# Altium project Controller-RK3562.PrjPcb (part 4 of 8)

## Sheet DDR-LPDDR4.SchDoc
size 420 x 297 mm; SheetNumber: 13; SheetTotal: 32
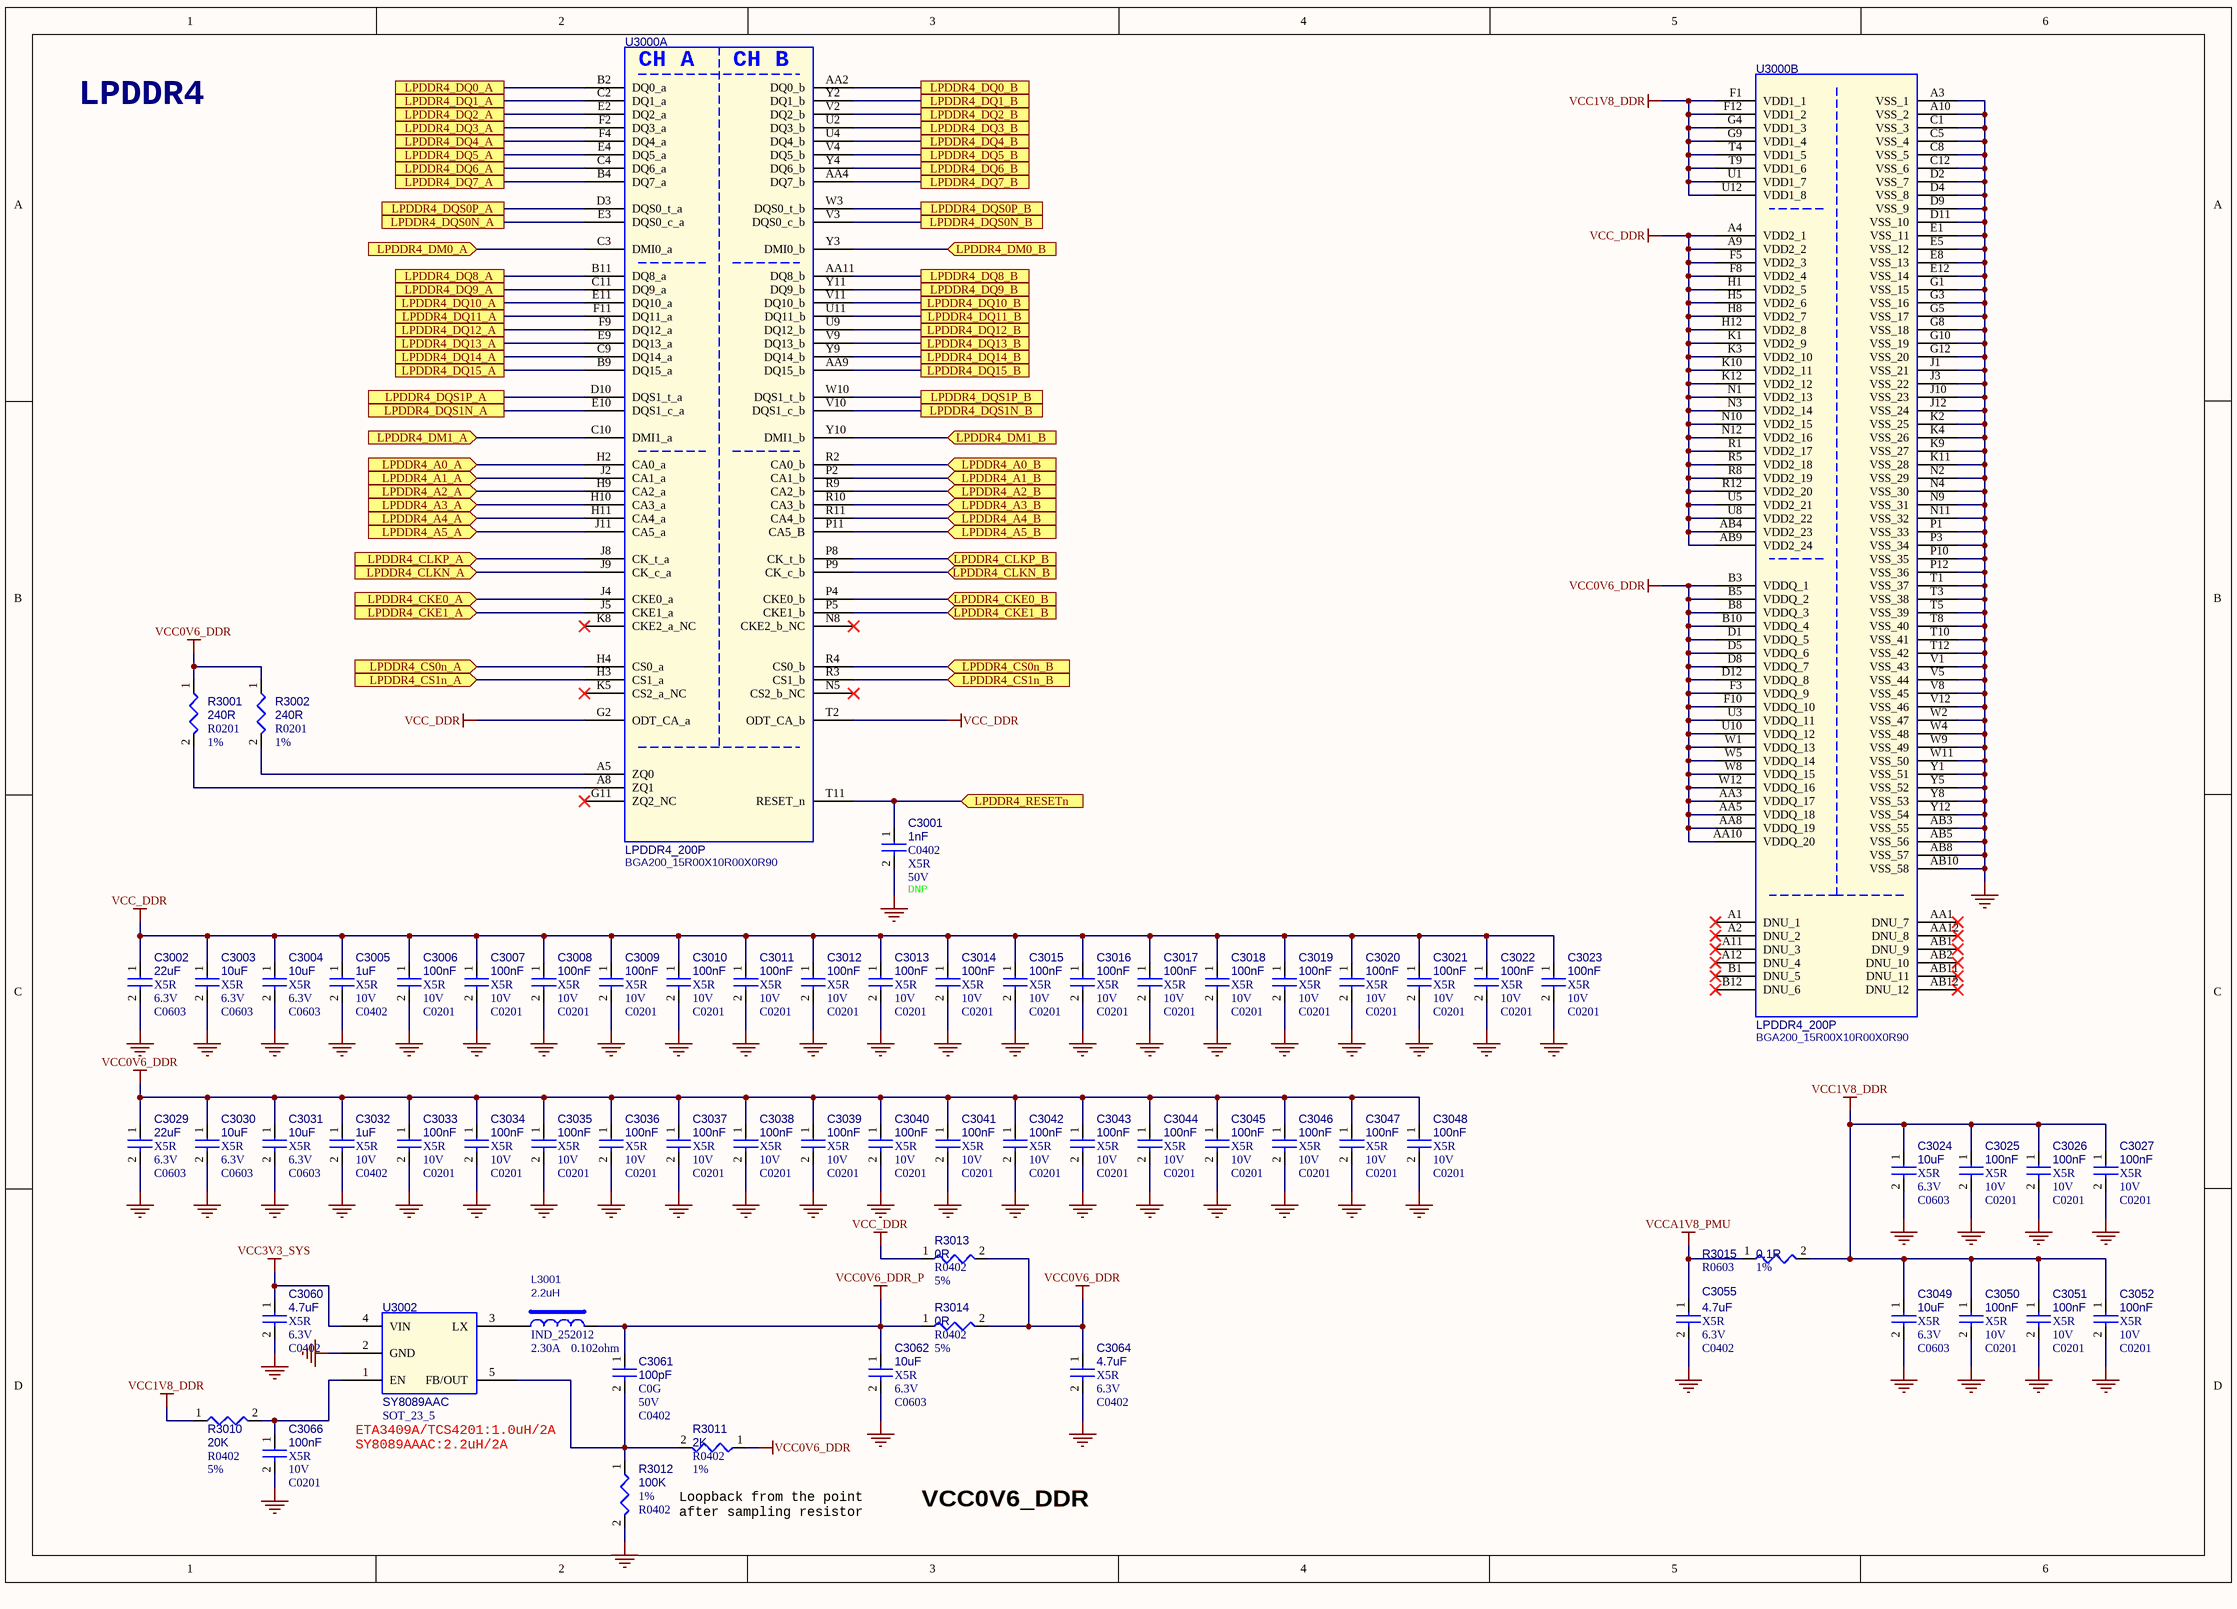
[diagram p14: DDR-LPDDR4.SchDoc]

### Parts
C3001  1nF  Dielectric: X5R  Voltage: 50V  option: DNP  [C0402]
C3002  22uF  Dielectric: X5R  Voltage: 6.3V  [C0603]
C3003  10uF  Dielectric: X5R  Voltage: 6.3V  [C0603]
C3004  10uF  Dielectric: X5R  Voltage: 6.3V  [C0603]
C3005  1uF  Dielectric: X5R  Voltage: 10V  [C0402]
C3006  100nF  Dielectric: X5R  Voltage: 10V  [C0201]
C3007  100nF  Dielectric: X5R  Voltage: 10V  [C0201]
C3008  100nF  Dielectric: X5R  Voltage: 10V  [C0201]
C3009  100nF  Dielectric: X5R  Voltage: 10V  [C0201]
C3010  100nF  Dielectric: X5R  Voltage: 10V  [C0201]
C3011  100nF  Dielectric: X5R  Voltage: 10V  [C0201]
C3012  100nF  Dielectric: X5R  Voltage: 10V  [C0201]
C3013  100nF  Dielectric: X5R  Voltage: 10V  [C0201]
C3014  100nF  Dielectric: X5R  Voltage: 10V  [C0201]
C3015  100nF  Dielectric: X5R  Voltage: 10V  [C0201]
C3016  100nF  Dielectric: X5R  Voltage: 10V  [C0201]
C3017  100nF  Dielectric: X5R  Voltage: 10V  [C0201]
C3018  100nF  Dielectric: X5R  Voltage: 10V  [C0201]
C3019  100nF  Dielectric: X5R  Voltage: 10V  [C0201]
C3020  100nF  Dielectric: X5R  Voltage: 10V  [C0201]
C3021  100nF  Dielectric: X5R  Voltage: 10V  [C0201]
C3022  100nF  Dielectric: X5R  Voltage: 10V  [C0201]
C3023  100nF  Dielectric: X5R  Voltage: 10V  [C0201]
C3024  10uF  Dielectric: X5R  Voltage: 6.3V  [C0603]
C3025  100nF  Dielectric: X5R  Voltage: 10V  [C0201]
C3026  100nF  Dielectric: X5R  Voltage: 10V  [C0201]
C3027  100nF  Dielectric: X5R  Voltage: 10V  [C0201]
C3029  22uF  Dielectric: X5R  Voltage: 6.3V  [C0603]
C3030  10uF  Dielectric: X5R  Voltage: 6.3V  [C0603]
C3031  10uF  Dielectric: X5R  Voltage: 6.3V  [C0603]
C3032  1uF  Dielectric: X5R  Voltage: 10V  [C0402]
C3033  100nF  Dielectric: X5R  Voltage: 10V  [C0201]
C3034  100nF  Dielectric: X5R  Voltage: 10V  [C0201]
C3035  100nF  Dielectric: X5R  Voltage: 10V  [C0201]
C3036  100nF  Dielectric: X5R  Voltage: 10V  [C0201]
C3037  100nF  Dielectric: X5R  Voltage: 10V  [C0201]
C3038  100nF  Dielectric: X5R  Voltage: 10V  [C0201]
C3039  100nF  Dielectric: X5R  Voltage: 10V  [C0201]
C3040  100nF  Dielectric: X5R  Voltage: 10V  [C0201]
C3041  100nF  Dielectric: X5R  Voltage: 10V  [C0201]
C3042  100nF  Dielectric: X5R  Voltage: 10V  [C0201]
C3043  100nF  Dielectric: X5R  Voltage: 10V  [C0201]
C3044  100nF  Dielectric: X5R  Voltage: 10V  [C0201]
C3045  100nF  Dielectric: X5R  Voltage: 10V  [C0201]
C3046  100nF  Dielectric: X5R  Voltage: 10V  [C0201]
C3047  100nF  Dielectric: X5R  Voltage: 10V  [C0201]
C3048  100nF  Dielectric: X5R  Voltage: 10V  [C0201]
C3049  10uF  Dielectric: X5R  Voltage: 6.3V  [C0603]
C3050  100nF  Dielectric: X5R  Voltage: 10V  [C0201]
C3051  100nF  Dielectric: X5R  Voltage: 10V  [C0201]
C3052  100nF  Dielectric: X5R  Voltage: 10V  [C0201]
C3055  4.7uF  Dielectric: X5R  Voltage: 6.3V  [C0402]
C3060  4.7uF  Dielectric: X5R  Voltage: 6.3V  [C0402]
C3061  100pF  Dielectric: C0G  Voltage: 50V  [C0402]
C3062  10uF  Dielectric: X5R  Voltage: 6.3V  [C0603]
C3064  4.7uF  Dielectric: X5R  Voltage: 6.3V  [C0402]
C3066  100nF  Dielectric: X5R  Voltage: 10V  [C0201]
L3001  2.2uH  Isat: 2.30A  DC Resistor: 0.102ohm  [IND_252012]
R3001  240R  Tolerance: 1%  [R0201]
R3002  240R  Tolerance: 1%  [R0201]
R3010  20K  Tolerance: 5%  [R0402]
R3011  2K  Tolerance: 1%  [R0402]
R3012  100K  Tolerance: 1%  [R0402]
R3013  0R  Tolerance: 5%  [R0402]
R3014  0R  Tolerance: 5%  [R0402]
R3015  0.1R  Tolerance: 1%  [R0603]
U3000  LPDDR4_200P  [BGA200_15R00X10R00X0R90]  (parts A,B of 2)
U3002  SY8089AAC  [SOT_23_5]

### Ports
LPDDR4_A0_A (in, see CONTROLLER-RK3562[7B], RK3562-DDR-PHY[5B]), LPDDR4_A0_B (in, see CONTROLLER-RK3562[7C], RK3562-DDR-PHY[5B]), LPDDR4_A1_A (in, see CONTROLLER-RK3562[7B], RK3562-DDR-PHY[5A]), LPDDR4_A1_B (in, see CONTROLLER-RK3562[7C], RK3562-DDR-PHY[5A]), LPDDR4_A2_A (in, see CONTROLLER-RK3562[7B], RK3562-DDR-PHY[5B]), LPDDR4_A2_B (in, see CONTROLLER-RK3562[7C], RK3562-DDR-PHY[5B]), LPDDR4_A3_A (in, see CONTROLLER-RK3562[7B], RK3562-DDR-PHY[5B]), LPDDR4_A3_B (in, see CONTROLLER-RK3562[7C], RK3562-DDR-PHY[5A]), LPDDR4_A4_A (in, see CONTROLLER-RK3562[7B], RK3562-DDR-PHY[5B]), LPDDR4_A4_B (in, see CONTROLLER-RK3562[7C], RK3562-DDR-PHY[5B]), LPDDR4_A5_A (in, see CONTROLLER-RK3562[7B], RK3562-DDR-PHY[5B]), LPDDR4_A5_B (in, see CONTROLLER-RK3562[7C], RK3562-DDR-PHY[5A]), LPDDR4_CKE0_A (in, see CONTROLLER-RK3562[7B], RK3562-DDR-PHY[5B]), LPDDR4_CKE0_B (in, see CONTROLLER-RK3562[7C], RK3562-DDR-PHY[5B]), LPDDR4_CKE1_A (in, see CONTROLLER-RK3562[7B], RK3562-DDR-PHY[5B]), LPDDR4_CKE1_B (in, see CONTROLLER-RK3562[7C], RK3562-DDR-PHY[5B]), LPDDR4_CLKN_A (in, see CONTROLLER-RK3562[7B], RK3562-DDR-PHY[5B]), LPDDR4_CLKN_B (in, see CONTROLLER-RK3562[7C], RK3562-DDR-PHY[5A]), LPDDR4_CLKP_A (in, see CONTROLLER-RK3562[7B], RK3562-DDR-PHY[5B]), LPDDR4_CLKP_B (in, see CONTROLLER-RK3562[7C], RK3562-DDR-PHY[5B]), LPDDR4_CS0n_A (in, see CONTROLLER-RK3562[7B], RK3562-DDR-PHY[5A]), LPDDR4_CS0n_B (in, see CONTROLLER-RK3562[7C], RK3562-DDR-PHY[5B]), LPDDR4_CS1n_A (in, see CONTROLLER-RK3562[7B], RK3562-DDR-PHY[5B]), LPDDR4_CS1n_B (in, see CONTROLLER-RK3562[7C], RK3562-DDR-PHY[5B]), LPDDR4_DM0_A (in, see CONTROLLER-RK3562[7B], RK3562-DDR-PHY[1B]), LPDDR4_DM0_B (in, see CONTROLLER-RK3562[7C], RK3562-DDR-PHY[1C]), LPDDR4_DM1_A (in, see CONTROLLER-RK3562[7B], RK3562-DDR-PHY[1B]), LPDDR4_DM1_B (in, see CONTROLLER-RK3562[7C], RK3562-DDR-PHY[1C]), LPDDR4_DQ0_A (see CONTROLLER-RK3562[7B], RK3562-DDR-PHY[1A]), LPDDR4_DQ0_B (see CONTROLLER-RK3562[7C], RK3562-DDR-PHY[1B]), LPDDR4_DQ1_A (see CONTROLLER-RK3562[7B], RK3562-DDR-PHY[1A]), LPDDR4_DQ1_B (see CONTROLLER-RK3562[7C], RK3562-DDR-PHY[1B]), LPDDR4_DQ2_A (see CONTROLLER-RK3562[7B], RK3562-DDR-PHY[1A]), LPDDR4_DQ2_B (see CONTROLLER-RK3562[7C], RK3562-DDR-PHY[1B]), LPDDR4_DQ3_A (see CONTROLLER-RK3562[7B], RK3562-DDR-PHY[1A]), LPDDR4_DQ3_B (see CONTROLLER-RK3562[7C], RK3562-DDR-PHY[1B]), LPDDR4_DQ4_A (see CONTROLLER-RK3562[7B], RK3562-DDR-PHY[1A]), LPDDR4_DQ4_B (see CONTROLLER-RK3562[7C], RK3562-DDR-PHY[1B]), LPDDR4_DQ5_A (see CONTROLLER-RK3562[7B], RK3562-DDR-PHY[1A]), LPDDR4_DQ5_B (see CONTROLLER-RK3562[7C], RK3562-DDR-PHY[1B]), LPDDR4_DQ6_A (see CONTROLLER-RK3562[7B], RK3562-DDR-PHY[1A]), LPDDR4_DQ6_B (see CONTROLLER-RK3562[7C], RK3562-DDR-PHY[1B]), LPDDR4_DQ7_A (see CONTROLLER-RK3562[7B], RK3562-DDR-PHY[1A]), LPDDR4_DQ7_B (see CONTROLLER-RK3562[7C], RK3562-DDR-PHY[1C]), LPDDR4_DQ8_A (see CONTROLLER-RK3562[7B], RK3562-DDR-PHY[1B]), LPDDR4_DQ8_B (see CONTROLLER-RK3562[7C], RK3562-DDR-PHY[1C]), LPDDR4_DQ9_A (see CONTROLLER-RK3562[7B], RK3562-DDR-PHY[1B]), LPDDR4_DQ9_B (see CONTROLLER-RK3562[7C], RK3562-DDR-PHY[1C]), LPDDR4_DQ10_A (see CONTROLLER-RK3562[7B], RK3562-DDR-PHY[1B]), LPDDR4_DQ10_B (see CONTROLLER-RK3562[7C], RK3562-DDR-PHY[1C]), LPDDR4_DQ11_A (see CONTROLLER-RK3562[7B], RK3562-DDR-PHY[1B]), LPDDR4_DQ11_B (see CONTROLLER-RK3562[7C], RK3562-DDR-PHY[1C]), LPDDR4_DQ12_A (see CONTROLLER-RK3562[7B], RK3562-DDR-PHY[1B]), LPDDR4_DQ12_B (see CONTROLLER-RK3562[7C], RK3562-DDR-PHY[1C]), LPDDR4_DQ13_A (see CONTROLLER-RK3562[7B], RK3562-DDR-PHY[1B]), LPDDR4_DQ13_B (see CONTROLLER-RK3562[7C], RK3562-DDR-PHY[1C]), LPDDR4_DQ14_A (see CONTROLLER-RK3562[7B], RK3562-DDR-PHY[1B]), LPDDR4_DQ14_B (see CONTROLLER-RK3562[7C], RK3562-DDR-PHY[1C]), LPDDR4_DQ15_A (see CONTROLLER-RK3562[7B], RK3562-DDR-PHY[1B]), LPDDR4_DQ15_B (see CONTROLLER-RK3562[7C], RK3562-DDR-PHY[1C]), LPDDR4_DQS0N_A (see CONTROLLER-RK3562[7B], RK3562-DDR-PHY[1B]), LPDDR4_DQS0N_B (see CONTROLLER-RK3562[7C], RK3562-DDR-PHY[1C]), LPDDR4_DQS0P_A (see CONTROLLER-RK3562[7B], RK3562-DDR-PHY[1B]), LPDDR4_DQS0P_B (see CONTROLLER-RK3562[7C], RK3562-DDR-PHY[1C]), LPDDR4_DQS1N_A (see CONTROLLER-RK3562[7B], RK3562-DDR-PHY[1B]), LPDDR4_DQS1N_B (see CONTROLLER-RK3562[7C], RK3562-DDR-PHY[1C]), LPDDR4_DQS1P_A (see CONTROLLER-RK3562[7B], RK3562-DDR-PHY[1B]), LPDDR4_DQS1P_B (see CONTROLLER-RK3562[7C], RK3562-DDR-PHY[1C]), LPDDR4_RESETn (in, see CONTROLLER-RK3562[7C], RK3562-DDR-PHY[5C])

### Nets
GND: C3001.2 C3002.2 C3003.2 C3004.2 C3005.2 C3006.2 C3007.2 C3008.2 C3009.2 C3010.2 C3011.2 C3012.2 C3013.2 C3014.2 C3015.2 C3016.2 C3017.2 C3018.2 C3019.2 C3020.2 C3021.2 C3022.2 C3023.2 C3024.2 C3025.2 C3026.2 C3027.2 C3029.2 C3030.2 C3031.2 C3032.2 C3033.2 C3034.2 C3035.2 C3036.2 C3037.2 C3038.2 C3039.2 C3040.2 C3041.2 C3042.2 C3043.2 C3044.2 C3045.2 C3046.2 C3047.2 C3048.2 C3049.2 C3050.2 C3051.2 C3052.2 C3055.2 C3060.2 C3062.2 C3064.2 C3066.2 R3012.2 U3000.A3(VSS_1) U3000.A10(VSS_2) U3000.AB3(VSS_55) U3000.AB5(VSS_56) U3000.AB8(VSS_57) U3000.AB10(VSS_58) U3000.C1(VSS_3) U3000.C5(VSS_4) U3000.C8(VSS_5) U3000.C12(VSS_6) U3000.D2(VSS_7) U3000.D4(VSS_8) U3000.D9(VSS_9) U3000.D11(VSS_10) U3000.E1(VSS_11) U3000.E5(VSS_12) U3000.E8(VSS_13) U3000.E12(VSS_14) U3000.G1(VSS_15) U3000.G3(VSS_16) U3000.G5(VSS_17) U3000.G8(VSS_18) U3000.G10(VSS_19) U3000.G12(VSS_20) U3000.J1(VSS_21) U3000.J3(VSS_22) U3000.J10(VSS_23) U3000.J12(VSS_24) U3000.K2(VSS_25) U3000.K4(VSS_26) U3000.K9(VSS_27) U3000.K11(VSS_28) U3000.N2(VSS_29) U3000.N4(VSS_30) U3000.N9(VSS_31) U3000.N11(VSS_32) U3000.P1(VSS_33) U3000.P3(VSS_34) U3000.P10(VSS_35) U3000.P12(VSS_36) U3000.T1(VSS_37) U3000.T3(VSS_38) U3000.T5(VSS_39) U3000.T8(VSS_40) U3000.T10(VSS_41) U3000.T12(VSS_42) U3000.V1(VSS_43) U3000.V5(VSS_44) U3000.V8(VSS_45) U3000.V12(VSS_46) U3000.W2(VSS_47) U3000.W4(VSS_48) U3000.W9(VSS_49) U3000.W11(VSS_50) U3000.Y1(VSS_51) U3000.Y5(VSS_52) U3000.Y8(VSS_53) U3000.Y12(VSS_54) U3002.2(GND)
VCC0V6_DDR: C3029.1 C3030.1 C3031.1 C3032.1 C3033.1 C3034.1 C3035.1 C3036.1 C3037.1 C3038.1 C3039.1 C3040.1 C3041.1 C3042.1 C3043.1 C3044.1 C3045.1 C3046.1 C3047.1 C3048.1 C3064.1 R3001.1 R3002.1 R3011.1 R3013.2 R3014.2 U3000.AA3(VDDQ_17) U3000.AA5(VDDQ_18) U3000.AA8(VDDQ_19) U3000.AA10(VDDQ_20) U3000.B3(VDDQ_1) U3000.B5(VDDQ_2) U3000.B8(VDDQ_3) U3000.B10(VDDQ_4) U3000.D1(VDDQ_5) U3000.D5(VDDQ_6) U3000.D8(VDDQ_7) U3000.D12(VDDQ_8) U3000.F3(VDDQ_9) U3000.F10(VDDQ_10) U3000.U3(VDDQ_11) U3000.U10(VDDQ_12) U3000.W1(VDDQ_13) U3000.W5(VDDQ_14) U3000.W8(VDDQ_15) U3000.W12(VDDQ_16)
VCC0V6_DDR_P: C3061.1 C3062.1 L3001.2 R3014.1
VCC1V8_DDR: C3024.1 C3025.1 C3026.1 C3027.1 C3049.1 C3050.1 C3051.1 C3052.1 R3010.1 R3015.2 U3000.F1(VDD1_1) U3000.F12(VDD1_2) U3000.G4(VDD1_3) U3000.G9(VDD1_4) U3000.T4(VDD1_5) U3000.T9(VDD1_6) U3000.U1(VDD1_7) U3000.U12(VDD1_8)
VCC3V3_SYS: C3060.1 U3002.4(VIN)
VCC_DDR: C3002.1 C3003.1 C3004.1 C3005.1 C3006.1 C3007.1 C3008.1 C3009.1 C3010.1 C3011.1 C3012.1 C3013.1 C3014.1 C3015.1 C3016.1 C3017.1 C3018.1 C3019.1 C3020.1 C3021.1 C3022.1 C3023.1 R3013.1 U3000.A4(VDD2_1) U3000.A9(VDD2_2) U3000.AB4(VDD2_23) U3000.AB9(VDD2_24) U3000.F5(VDD2_3) U3000.F8(VDD2_4) U3000.G2(ODT_CA_a) U3000.H1(VDD2_5) U3000.H5(VDD2_6) U3000.H8(VDD2_7) U3000.H12(VDD2_8) U3000.K1(VDD2_9) U3000.K3(VDD2_10) U3000.K10(VDD2_11) U3000.K12(VDD2_12) U3000.N1(VDD2_13) U3000.N3(VDD2_14) U3000.N10(VDD2_15) U3000.N12(VDD2_16) U3000.R1(VDD2_17) U3000.R5(VDD2_18) U3000.R8(VDD2_19) U3000.R12(VDD2_20) U3000.T2(ODT_CA_b) U3000.U5(VDD2_21) U3000.U8(VDD2_22)
VCCA1V8_PMU: C3055.1 R3015.1
NetC3001_1: C3001.1 U3000.T11(RESET_n) ; port LPDDR4_RESETn
NetC3061_2: C3061.2 R3011.2 R3012.1 U3002.5(FB/OUT)
NetC3066_1: C3066.1 R3010.2 U3002.1(EN)
NetL3001_1: L3001.1 U3002.3(LX)
NetR3001_2: R3001.2 U3000.A8(ZQ1)
NetR3002_2: R3002.2 U3000.A5(ZQ0)
NetU1000_1A1: U3000.D10(DQS1_t_a) ; port LPDDR4_DQS1P_A
NetU1000_1A3: U3000.D3(DQS0_t_a) ; port LPDDR4_DQS0P_A
NetU1000_1A6: U3000.H10(CA3_a) ; port LPDDR4_A3_A
NetU1000_1A7: U3000.J11(CA5_a) ; port LPDDR4_A5_A
NetU1000_1A8: U3000.P11(CA5_B) ; port LPDDR4_A5_B
NetU1000_1A9: U3000.R11(CA4_b) ; port LPDDR4_A4_B
NetU1000_1A10: U3000.R10(CA3_b) ; port LPDDR4_A3_B
NetU1000_1A13: U3000.W3(DQS0_t_b) ; port LPDDR4_DQS0P_B
NetU1000_1A15: U3000.W10(DQS1_t_b) ; port LPDDR4_DQS1P_B
NetU1000_1B1: U3000.E10(DQS1_c_a) ; port LPDDR4_DQS1N_A
NetU1000_1B3: U3000.E3(DQS0_c_a) ; port LPDDR4_DQS0N_A
NetU1000_1B8: U3000.H11(CA4_a) ; port LPDDR4_A4_A
NetU1000_1B13: U3000.V3(DQS0_c_b) ; port LPDDR4_DQS0N_B
NetU1000_1B15: U3000.V10(DQS1_c_b) ; port LPDDR4_DQS1N_B
NetU1000_A2: U3000.C10(DMI1_a) ; port LPDDR4_DM1_A
NetU1000_A3: U3000.C9(DQ14_a) ; port LPDDR4_DQ14_A
NetU1000_A4: U3000.F9(DQ12_a) ; port LPDDR4_DQ12_A
NetU1000_A6: U3000.C4(DQ6_a) ; port LPDDR4_DQ6_A
NetU1000_A8: U3000.E2(DQ2_a) ; port LPDDR4_DQ2_A
NetU1000_A10: U3000.J2(CA1_a) ; port LPDDR4_A1_A
NetU1000_A13: U3000.J9(CK_c_a) ; port LPDDR4_CLKN_A
NetU1000_A15: U3000.P9(CK_c_b) ; port LPDDR4_CLKN_B
NetU1000_A18: U3000.P2(CA1_b) ; port LPDDR4_A1_B
NetU1000_A20: U3000.V2(DQ2_b) ; port LPDDR4_DQ2_B
NetU1000_A22: U3000.AA4(DQ7_b) ; port LPDDR4_DQ7_B
NetU1000_A24: U3000.U9(DQ12_b) ; port LPDDR4_DQ12_B
NetU1000_A25: U3000.Y9(DQ14_b) ; port LPDDR4_DQ14_B
NetU1000_A26: U3000.Y10(DMI1_b) ; port LPDDR4_DM1_B
NetU1000_B1: U3000.E11(DQ10_a) ; port LPDDR4_DQ10_A
NetU1000_B2: U3000.F11(DQ11_a) ; port LPDDR4_DQ11_A
NetU1000_B3: U3000.B9(DQ15_a) ; port LPDDR4_DQ15_A
NetU1000_B4: U3000.E9(DQ13_a) ; port LPDDR4_DQ13_A
NetU1000_B5: U3000.E4(DQ5_a) ; port LPDDR4_DQ5_A
NetU1000_B6: U3000.B2(DQ0_a) ; port LPDDR4_DQ0_A
NetU1000_B7: U3000.C3(DMI0_a) ; port LPDDR4_DM0_A
NetU1000_B8: U3000.C2(DQ1_a) ; port LPDDR4_DQ1_A
NetU1000_B10: U3000.H2(CA0_a) ; port LPDDR4_A0_A
NetU1000_B11: U3000.H4(CS0_a) ; port LPDDR4_CS0n_A
NetU1000_B12: U3000.J5(CKE1_a) ; port LPDDR4_CKE1_A
NetU1000_B13: U3000.J8(CK_t_a) ; port LPDDR4_CLKP_A
NetU1000_B15: U3000.P8(CK_t_b) ; port LPDDR4_CLKP_B
NetU1000_B16: U3000.P5(CKE1_b) ; port LPDDR4_CKE1_B
NetU1000_B17: U3000.R4(CS0_b) ; port LPDDR4_CS0n_B
NetU1000_B18: U3000.R2(CA0_b) ; port LPDDR4_A0_B
NetU1000_B20: U3000.Y2(DQ1_b) ; port LPDDR4_DQ1_B
NetU1000_B21: U3000.Y3(DMI0_b) ; port LPDDR4_DM0_B
NetU1000_B22: U3000.AA2(DQ0_b) ; port LPDDR4_DQ0_B
NetU1000_B23: U3000.V4(DQ5_b) ; port LPDDR4_DQ5_B
NetU1000_B24: U3000.V9(DQ13_b) ; port LPDDR4_DQ13_B
NetU1000_B25: U3000.AA9(DQ15_b) ; port LPDDR4_DQ15_B
NetU1000_B26: U3000.U11(DQ11_b) ; port LPDDR4_DQ11_B
NetU1000_B27: U3000.V11(DQ10_b) ; port LPDDR4_DQ10_B
NetU1000_C1: U3000.C11(DQ9_a) ; port LPDDR4_DQ9_A
NetU1000_C2: U3000.B11(DQ8_a) ; port LPDDR4_DQ8_A
NetU1000_C5: U3000.F4(DQ4_a) ; port LPDDR4_DQ4_A
NetU1000_C6: U3000.B4(DQ7_a) ; port LPDDR4_DQ7_A
NetU1000_C8: U3000.F2(DQ3_a) ; port LPDDR4_DQ3_A
NetU1000_C10: U3000.H9(CA2_a) ; port LPDDR4_A2_A
NetU1000_C11: U3000.H3(CS1_a) ; port LPDDR4_CS1n_A
NetU1000_C12: U3000.J4(CKE0_a) ; port LPDDR4_CKE0_A
NetU1000_C16: U3000.P4(CKE0_b) ; port LPDDR4_CKE0_B
NetU1000_C17: U3000.R3(CS1_b) ; port LPDDR4_CS1n_B
NetU1000_C18: U3000.R9(CA2_b) ; port LPDDR4_A2_B
NetU1000_C20: U3000.U2(DQ3_b) ; port LPDDR4_DQ3_B
NetU1000_C22: U3000.Y4(DQ6_b) ; port LPDDR4_DQ6_B
NetU1000_C23: U3000.U4(DQ4_b) ; port LPDDR4_DQ4_B
NetU1000_C26: U3000.AA11(DQ8_b) ; port LPDDR4_DQ8_B
NetU1000_C27: U3000.Y11(DQ9_b) ; port LPDDR4_DQ9_B

Not connected (* = marked no-connect by the designer): U3000 A1(DNU_1)* A2(DNU_2)* A11(DNU_3)* A12(DNU_4)* AA1(DNU_7)* AA12(DNU_8)* AB1(DNU_9)* AB2(DNU_10)* AB11(DNU_11)* AB12(DNU_12)* B1(DNU_5)* B12(DNU_6)* G11(ZQ2_NC)* K5(CS2_a_NC)* K8(CKE2_a_NC)* N5(CS2_b_NC)* N8(CKE2_b_NC)*

### Notes on the sheet
- LPDDR4
- (near U3002) ETA3409A/TCS4201:1.0uH/2A
  SY8089AAAC:2.2uH/2A
- Loopback from the point
  after sampling resistor
- VCC0V6_DDR
- (in symbol LPDDR4_200P_0, part A) CH A; CH B

### Library data of the parts
C3001 = CAP NP: cap,1.00nF,+/-10%,50V,X5R,C0402; Part Reference: C3001; Manufacturer: TDK; RK PN: C1005X5R1H102K050BA; Priority: A; Tolerance: 10%; PCB Footprint: C0402; Value: 1nF; Part Type: C0402; Manufacturer PN: C1005X5R1H102K050BA; Created by: JJJ; ClassName: RK
C3002 = CAP NP: cap,22.00uF,+/-20%,6.3V,X5R,C0603; Part Reference: C3002; Manufacturer PN: C1608X5R0J226M080AC; Manufacturer: TDK; Tolerance: 20%; Priority: A; PCB Footprint: C0603; Value: 22uF; Created by: JJJ; C_Voltage: 6.3V; Part Type: C0603; RK PN: C1608X5R0J226M080AC; ClassName: RK
C3003 = CAP NP: cap,10.00uF,+/-10%,6.3V,X5R,C0603; Part Reference: C3003; Manufacturer PN: C1608X5R0J106K080AB; Manufacturer: TDK; Tolerance: 10%; Priority: A; PCB Footprint: C0603; Value: 10uF; Created by: JJJ; C_Voltage: 6.3V; Part Type: C0603; RK PN: C1608X5R0J106K080AB; ClassName: RK
C3004 = CAP NP: cap,10.00uF,+/-10%,6.3V,X5R,C0603; Part Reference: C3004; Manufacturer: TDK; RK PN: C1608X5R0J106K080AB; Priority: A; Tolerance: 10%; PCB Footprint: C0603; Value: 10uF; Part Type: C0603; C_Voltage: 6.3V; Manufacturer PN: C1608X5R0J106K080AB; Created by: JJJ; ClassName: RK
C3005 = CAP NP: cap,1.00uF,+/-10%,10V,X5R,C0402; Part Reference: C3005; Manufacturer PN: C1005X5R1A105K050BB; Manufacturer: TDK; Tolerance: 10%; Priority: A; PCB Footprint: C0402; Value: 1uF; Created by: JJJ; Part Type: C0402; RK PN: C1005X5R1A105K050BB; ClassName: RK
C3006 = CAP NP: cap,100.00nF,+/-10%,10V,X5R,C0201; Part Reference: C3006; Manufacturer PN: C0603X5R1A104K030BC; Manufacturer: TDK; Tolerance: 10%; Priority: A; PCB Footprint: C0201; Value: 100nF; Created by: JJJ; Part Type: C0201; RK PN: C0603X5R1A104K030BC; ClassName: RK
C3007 = CAP NP: cap,100.00nF,+/-10%,10V,X5R,C0201; Part Reference: C3007; Manufacturer PN: C0603X5R1A104K030BC; Manufacturer: TDK; Tolerance: 10%; Priority: A; PCB Footprint: C0201; Value: 100nF; Created by: JJJ; Part Type: C0201; RK PN: C0603X5R1A104K030BC; ClassName: RK
C3008 = CAP NP: cap,100.00nF,+/-10%,10V,X5R,C0201; Part Reference: C3008; Manufacturer PN: C0603X5R1A104K030BC; Manufacturer: TDK; Tolerance: 10%; Priority: A; PCB Footprint: C0201; Value: 100nF; Created by: JJJ; Part Type: C0201; RK PN: C0603X5R1A104K030BC; ClassName: RK
C3009 = CAP NP: cap,100.00nF,+/-10%,10V,X5R,C0201; Part Reference: C3009; Manufacturer PN: C0603X5R1A104K030BC; Manufacturer: TDK; Tolerance: 10%; Priority: A; PCB Footprint: C0201; Value: 100nF; Created by: JJJ; Part Type: C0201; RK PN: C0603X5R1A104K030BC; ClassName: RK
C3010 = CAP NP: cap,100.00nF,+/-10%,10V,X5R,C0201; Part Reference: C3010; Manufacturer PN: C0603X5R1A104K030BC; Manufacturer: TDK; Tolerance: 10%; Priority: A; PCB Footprint: C0201; Value: 100nF; Created by: JJJ; Part Type: C0201; RK PN: C0603X5R1A104K030BC; ClassName: RK
C3011 = CAP NP: cap,100.00nF,+/-10%,10V,X5R,C0201; Part Reference: C3011; Manufacturer PN: C0603X5R1A104K030BC; Manufacturer: TDK; Tolerance: 10%; Priority: A; PCB Footprint: C0201; Value: 100nF; Created by: JJJ; Part Type: C0201; RK PN: C0603X5R1A104K030BC; ClassName: RK
C3012 = CAP NP: cap,100.00nF,+/-10%,10V,X5R,C0201; Part Reference: C3012; Manufacturer: TDK; RK PN: C0603X5R1A104K030BC; Priority: A; Tolerance: 10%; PCB Footprint: C0201; Value: 100nF; Part Type: C0201; Manufacturer PN: C0603X5R1A104K030BC; Created by: JJJ; ClassName: RK
C3013 = CAP NP: cap,100.00nF,+/-10%,10V,X5R,C0201; Part Reference: C3013; Manufacturer: TDK; RK PN: C0603X5R1A104K030BC; Priority: A; Tolerance: 10%; PCB Footprint: C0201; Value: 100nF; Part Type: C0201; Manufacturer PN: C0603X5R1A104K030BC; Created by: JJJ; ClassName: RK
C3014 = CAP NP: cap,100.00nF,+/-10%,10V,X5R,C0201; Part Reference: C3014; Manufacturer: TDK; RK PN: C0603X5R1A104K030BC; Priority: A; Tolerance: 10%; PCB Footprint: C0201; Value: 100nF; Part Type: C0201; Manufacturer PN: C0603X5R1A104K030BC; Created by: JJJ; ClassName: RK
C3015 = CAP NP: cap,100.00nF,+/-10%,10V,X5R,C0201; Part Reference: C3015; Manufacturer: TDK; RK PN: C0603X5R1A104K030BC; Priority: A; Tolerance: 10%; PCB Footprint: C0201; Value: 100nF; Part Type: C0201; Manufacturer PN: C0603X5R1A104K030BC; Created by: JJJ; ClassName: RK
C3016 = CAP NP: cap,100.00nF,+/-10%,10V,X5R,C0201; Part Reference: C3016; Manufacturer: TDK; RK PN: C0603X5R1A104K030BC; Priority: A; Tolerance: 10%; PCB Footprint: C0201; Value: 100nF; Part Type: C0201; Manufacturer PN: C0603X5R1A104K030BC; Created by: JJJ; ClassName: RK
C3017 = CAP NP: cap,100.00nF,+/-10%,10V,X5R,C0201; Part Reference: C3017; Manufacturer PN: C0603X5R1A104K030BC; Manufacturer: TDK; Tolerance: 10%; Priority: A; PCB Footprint: C0201; Value: 100nF; Created by: JJJ; Part Type: C0201; RK PN: C0603X5R1A104K030BC; ClassName: RK
C3018 = CAP NP: cap,100.00nF,+/-10%,10V,X5R,C0201; Part Reference: C3018; Manufacturer PN: C0603X5R1A104K030BC; Manufacturer: TDK; Tolerance: 10%; Priority: A; PCB Footprint: C0201; Value: 100nF; Created by: JJJ; Part Type: C0201; RK PN: C0603X5R1A104K030BC; ClassName: RK
C3019 = CAP NP: cap,100.00nF,+/-10%,10V,X5R,C0201; Part Reference: C3019; Manufacturer: TDK; RK PN: C0603X5R1A104K030BC; Priority: A; Tolerance: 10%; PCB Footprint: C0201; Value: 100nF; Part Type: C0201; Manufacturer PN: C0603X5R1A104K030BC; Created by: JJJ; ClassName: RK
C3020 = CAP NP: cap,100.00nF,+/-10%,10V,X5R,C0201; Part Reference: C3020; Manufacturer: TDK; RK PN: C0603X5R1A104K030BC; Priority: A; Tolerance: 10%; PCB Footprint: C0201; Value: 100nF; Part Type: C0201; Manufacturer PN: C0603X5R1A104K030BC; Created by: JJJ; ClassName: RK
C3021 = CAP NP: cap,100.00nF,+/-10%,10V,X5R,C0201; Part Reference: C3021; Manufacturer: TDK; RK PN: C0603X5R1A104K030BC; Priority: A; Tolerance: 10%; PCB Footprint: C0201; Value: 100nF; Part Type: C0201; Manufacturer PN: C0603X5R1A104K030BC; Created by: JJJ; ClassName: RK
C3022 = CAP NP: cap,100.00nF,+/-10%,10V,X5R,C0201; Part Reference: C3022; Manufacturer PN: C0603X5R1A104K030BC; Manufacturer: TDK; Tolerance: 10%; Priority: A; PCB Footprint: C0201; Value: 100nF; Created by: JJJ; Part Type: C0201; RK PN: C0603X5R1A104K030BC; ClassName: RK
C3023 = CAP NP: cap,100.00nF,+/-10%,10V,X5R,C0201; Part Reference: C3023; Manufacturer PN: C0603X5R1A104K030BC; Manufacturer: TDK; Tolerance: 10%; Priority: A; PCB Footprint: C0201; Value: 100nF; Created by: JJJ; Part Type: C0201; RK PN: C0603X5R1A104K030BC; ClassName: RK
C3024 = CAP NP: cap,10.00uF,+/-10%,6.3V,X5R,C0603; Part Reference: C3024; Manufacturer: TDK; Number: 37; RK PN: C1608X5R0J106K080AB; Priority: A; Tolerance: 10%; PCB Footprint: C0603; Value: 10uF; Part Type: C0603; Manufacturer PN: C1608X5R0J106K080AB; C_Voltage: 6.3V; Created by: JJJ; ClassName: RK
C3025 = CAP NP: cap,100.00nF,+/-10%,10V,X5R,C0201; Part Reference: C3025; Manufacturer: TDK; RK PN: C0603X5R1A104K030BC; Priority: A; Tolerance: 10%; PCB Footprint: C0201; Value: 100nF; Part Type: C0201; Manufacturer PN: C0603X5R1A104K030BC; Created by: JJJ; ClassName: RK
C3026 = CAP NP: cap,100.00nF,+/-10%,10V,X5R,C0201; Part Reference: C3026; Manufacturer: TDK; RK PN: C0603X5R1A104K030BC; Priority: A; Tolerance: 10%; PCB Footprint: C0201; Value: 100nF; Part Type: C0201; Manufacturer PN: C0603X5R1A104K030BC; Created by: JJJ; ClassName: RK
C3027 = CAP NP: cap,100.00nF,+/-10%,10V,X5R,C0201; Part Reference: C3027; Manufacturer: TDK; RK PN: C0603X5R1A104K030BC; Priority: A; Tolerance: 10%; PCB Footprint: C0201; Value: 100nF; Part Type: C0201; Manufacturer PN: C0603X5R1A104K030BC; Created by: JJJ; ClassName: RK
C3029 = CAP NP: cap,22.00uF,+/-20%,6.3V,X5R,C0603; Part Reference: C3029; Manufacturer: TDK; RK PN: C1608X5R0J226M080AC; Priority: A; Tolerance: 20%; PCB Footprint: C0603; Value: 22uF; Part Type: C0603; C_Voltage: 6.3V; Manufacturer PN: C1608X5R0J226M080AC; Created by: JJJ; ClassName: RK
C3030 = CAP NP: cap,10.00uF,+/-10%,6.3V,X5R,C0603; Part Reference: C3030; Manufacturer PN: C1608X5R0J106K080AB; Manufacturer: TDK; Tolerance: 10%; Priority: A; PCB Footprint: C0603; Value: 10uF; Created by: JJJ; C_Voltage: 6.3V; Part Type: C0603; RK PN: C1608X5R0J106K080AB; ClassName: RK
C3031 = CAP NP: cap,10.00uF,+/-10%,6.3V,X5R,C0603; Part Reference: C3031; Manufacturer: TDK; RK PN: C1608X5R0J106K080AB; Priority: A; Tolerance: 10%; PCB Footprint: C0603; Value: 10uF; Part Type: C0603; C_Voltage: 6.3V; Manufacturer PN: C1608X5R0J106K080AB; Created by: JJJ; ClassName: RK
C3032 = CAP NP: cap,1.00uF,+/-10%,10V,X5R,C0402; Part Reference: C3032; Manufacturer: TDK; RK PN: C1005X5R1A105K050BB; Priority: A; Tolerance: 10%; PCB Footprint: C0402; Value: 1uF; Part Type: C0402; Manufacturer PN: C1005X5R1A105K050BB; Created by: JJJ; ClassName: RK
C3033 = CAP NP: cap,100.00nF,+/-10%,10V,X5R,C0201; Part Reference: C3033; Manufacturer: TDK; RK PN: C0603X5R1A104K030BC; Priority: A; Tolerance: 10%; PCB Footprint: C0201; Value: 100nF; Part Type: C0201; Manufacturer PN: C0603X5R1A104K030BC; Created by: JJJ; ClassName: RK
C3034 = CAP NP: cap,100.00nF,+/-10%,10V,X5R,C0201; Part Reference: C3034; Manufacturer PN: C0603X5R1A104K030BC; Manufacturer: TDK; Tolerance: 10%; Priority: A; PCB Footprint: C0201; Value: 100nF; Created by: JJJ; Part Type: C0201; RK PN: C0603X5R1A104K030BC; ClassName: RK
C3035 = CAP NP: cap,100.00nF,+/-10%,10V,X5R,C0201; Part Reference: C3035; Manufacturer: TDK; RK PN: C0603X5R1A104K030BC; Priority: A; Tolerance: 10%; PCB Footprint: C0201; Value: 100nF; Part Type: C0201; Manufacturer PN: C0603X5R1A104K030BC; Created by: JJJ; ClassName: RK
C3036 = CAP NP: cap,100.00nF,+/-10%,10V,X5R,C0201; Part Reference: C3036; Manufacturer: TDK; RK PN: C0603X5R1A104K030BC; Priority: A; Tolerance: 10%; PCB Footprint: C0201; Value: 100nF; Part Type: C0201; Manufacturer PN: C0603X5R1A104K030BC; Created by: JJJ; ClassName: RK
C3037 = CAP NP: cap,100.00nF,+/-10%,10V,X5R,C0201; Part Reference: C3037; Manufacturer: TDK; RK PN: C0603X5R1A104K030BC; Priority: A; Tolerance: 10%; PCB Footprint: C0201; Value: 100nF; Part Type: C0201; Manufacturer PN: C0603X5R1A104K030BC; Created by: JJJ; ClassName: RK
C3038 = CAP NP: cap,100.00nF,+/-10%,10V,X5R,C0201; Part Reference: C3038; Manufacturer: TDK; RK PN: C0603X5R1A104K030BC; Priority: A; Tolerance: 10%; PCB Footprint: C0201; Value: 100nF; Part Type: C0201; Manufacturer PN: C0603X5R1A104K030BC; Created by: JJJ; ClassName: RK
C3039 = CAP NP: cap,100.00nF,+/-10%,10V,X5R,C0201; Part Reference: C3039; Manufacturer PN: C0603X5R1A104K030BC; Manufacturer: TDK; Tolerance: 10%; Priority: A; PCB Footprint: C0201; Value: 100nF; Created by: JJJ; Part Type: C0201; RK PN: C0603X5R1A104K030BC; ClassName: RK
C3040 = CAP NP: cap,100.00nF,+/-10%,10V,X5R,C0201; Part Reference: C3040; Manufacturer PN: C0603X5R1A104K030BC; Manufacturer: TDK; Tolerance: 10%; Priority: A; PCB Footprint: C0201; Value: 100nF; Created by: JJJ; Part Type: C0201; RK PN: C0603X5R1A104K030BC; ClassName: RK
C3041 = CAP NP: cap,100.00nF,+/-10%,10V,X5R,C0201; Part Reference: C3041; Manufacturer PN: C0603X5R1A104K030BC; Manufacturer: TDK; Tolerance: 10%; Priority: A; PCB Footprint: C0201; Value: 100nF; Created by: JJJ; Part Type: C0201; RK PN: C0603X5R1A104K030BC; ClassName: RK
C3042 = CAP NP: cap,100.00nF,+/-10%,10V,X5R,C0201; Part Reference: C3042; Manufacturer PN: C0603X5R1A104K030BC; Manufacturer: TDK; Tolerance: 10%; Priority: A; PCB Footprint: C0201; Value: 100nF; Created by: JJJ; Part Type: C0201; RK PN: C0603X5R1A104K030BC; ClassName: RK
C3043 = CAP NP: cap,100.00nF,+/-10%,10V,X5R,C0201; Part Reference: C3043; Manufacturer: TDK; RK PN: C0603X5R1A104K030BC; Priority: A; Tolerance: 10%; PCB Footprint: C0201; Value: 100nF; Part Type: C0201; Manufacturer PN: C0603X5R1A104K030BC; Created by: JJJ; ClassName: RK
C3044 = CAP NP: cap,100.00nF,+/-10%,10V,X5R,C0201; Part Reference: C3044; Manufacturer: TDK; RK PN: C0603X5R1A104K030BC; Priority: A; Tolerance: 10%; PCB Footprint: C0201; Value: 100nF; Part Type: C0201; Manufacturer PN: C0603X5R1A104K030BC; Created by: JJJ; ClassName: RK
C3045 = CAP NP: cap,100.00nF,+/-10%,10V,X5R,C0201; Part Reference: C3045; Manufacturer: TDK; RK PN: C0603X5R1A104K030BC; Priority: A; Tolerance: 10%; PCB Footprint: C0201; Value: 100nF; Part Type: C0201; Manufacturer PN: C0603X5R1A104K030BC; Created by: JJJ; ClassName: RK
C3046 = CAP NP: cap,100.00nF,+/-10%,10V,X5R,C0201; Part Reference: C3046; Manufacturer PN: C0603X5R1A104K030BC; Manufacturer: TDK; Tolerance: 10%; Priority: A; PCB Footprint: C0201; Value: 100nF; Created by: JJJ; Part Type: C0201; RK PN: C0603X5R1A104K030BC; ClassName: RK
C3047 = CAP NP: cap,100.00nF,+/-10%,10V,X5R,C0201; Part Reference: C3047; Manufacturer PN: C0603X5R1A104K030BC; Manufacturer: TDK; Tolerance: 10%; Priority: A; PCB Footprint: C0201; Value: 100nF; Created by: JJJ; Part Type: C0201; RK PN: C0603X5R1A104K030BC; ClassName: RK
C3048 = CAP NP: cap,100.00nF,+/-10%,10V,X5R,C0201; Part Reference: C3048; Manufacturer: TDK; RK PN: C0603X5R1A104K030BC; Priority: A; Tolerance: 10%; PCB Footprint: C0201; Value: 100nF; Part Type: C0201; Manufacturer PN: C0603X5R1A104K030BC; Created by: JJJ; ClassName: RK
C3049 = CAP NP: cap,10.00uF,+/-10%,6.3V,X5R,C0603; Part Reference: C3049; Manufacturer: TDK; Number: 37; RK PN: C1608X5R0J106K080AB; Priority: A; Tolerance: 10%; PCB Footprint: C0603; Value: 10uF; Part Type: C0603; Manufacturer PN: C1608X5R0J106K080AB; C_Voltage: 6.3V; Created by: JJJ; ClassName: RK
C3050 = CAP NP: cap,100.00nF,+/-10%,10V,X5R,C0201; Part Reference: C3050; Manufacturer PN: C0603X5R1A104K030BC; Manufacturer: TDK; Tolerance: 10%; Priority: A; PCB Footprint: C0201; Value: 100nF; Created by: JJJ; Part Type: C0201; RK PN: C0603X5R1A104K030BC; ClassName: RK
C3051 = CAP NP: cap,100.00nF,+/-10%,10V,X5R,C0201; Part Reference: C3051; Manufacturer PN: C0603X5R1A104K030BC; Manufacturer: TDK; Tolerance: 10%; Priority: A; PCB Footprint: C0201; Value: 100nF; Created by: JJJ; Part Type: C0201; RK PN: C0603X5R1A104K030BC; ClassName: RK
C3052 = CAP NP: cap,100.00nF,+/-10%,10V,X5R,C0201; Part Reference: C3052; Manufacturer PN: C0603X5R1A104K030BC; Manufacturer: TDK; Tolerance: 10%; Priority: A; PCB Footprint: C0201; Value: 100nF; Created by: JJJ; Part Type: C0201; RK PN: C0603X5R1A104K030BC; ClassName: RK
C3055 = CAP NP: cap,4.70uF,+/-10%,6.3V,X5R,C0402; Part Reference: C3055; Manufacturer: TDK; Number: 37; RK PN: C1005X5R0J475K050BC; Priority: A; Tolerance: 10%; PCB Footprint: C0402; Value: 4.7uF; Part Type: C0402; Manufacturer PN: C1005X5R0J475K050BC; C_Voltage: 6.3V; Created by: JJJ; ClassName: RK
C3060 = CAP NP: cap,4.70uF,+/-10%,6.3V,X5R,C0402; Part Reference: C3060; Manufacturer PN: C1005X5R0J475K050BC; Manufacturer: TDK; Tolerance: 10%; Priority: A; Number: 37; PCB Footprint: C0402; Value: 4.7uF; Created by: JJJ; C_Voltage: 6.3V; Part Type: C0402; RK PN: C1005X5R0J475K050BC; ClassName: RK
C3061 = CAP NP: cap,100.00pF,+/-10%,50V,C0G,C0402; Part Reference: C3061; Manufacturer PN: C1005C0G1H101K050BA; Manufacturer: TDK; Tolerance: 10%; Priority: A; PCB Footprint: C0402; Value: 100pF; Created by: JJJ; Part Type: C0402; RK PN: C1005C0G1H101K050BA; ClassName: RK
C3062 = CAP NP: cap,10.00uF,+/-10%,6.3V,X5R,C0603; Part Reference: C3062; Manufacturer: TDK; RK PN: C1608X5R0J106K080AB; Priority: A; Tolerance: 10%; PCB Footprint: C0603; Value: 10uF; Part Type: C0603; C_Voltage: 6.3V; Manufacturer PN: C1608X5R0J106K080AB; Created by: JJJ; ClassName: RK
C3064 = CAP NP: cap,4.70uF,+/-10%,6.3V,X5R,C0402; Part Reference: C3064; Manufacturer PN: C1005X5R0J475K050BC; Manufacturer: TDK; Tolerance: 10%; Priority: A; Number: 37; PCB Footprint: C0402; Value: 4.7uF; Created by: JJJ; C_Voltage: 6.3V; Part Type: C0402; RK PN: C1005X5R0J475K050BC; ClassName: RK
C3066 = CAP NP: cap,100.00nF,+/-10%,10V,X5R,C0201; Part Reference: C3066; Manufacturer: TDK; RK PN: C0603X5R1A104K030BC; Priority: A; Tolerance: 10%; PCB Footprint: C0201; Value: 100nF; Part Type: C0201; Manufacturer PN: C0603X5R1A104K030BC; Created by: JJJ; ClassName: RK
L3001 = INDUCTORS OF FERRITE: Power Inductor,2.2uH,20%,IND_252012; Part Reference: L3001; Manufacturer PN: VLS252012HBX-2R2M; Manufacturer: TDK; Resonace frequency: 1MHz; Irms: 2.04A; Priority: A; PCB Footprint: IND_252012; Value: 2.2uH; Created by: JJJ; Tolerance: 20%; Part Type: POWER_IND; RK PN: VLS252012HBX-2R2M; ClassName: RK
R3001 = RESISTOR: 通用厚膜电阻,240R,+/-1%,R0201,1/20W.; Part Reference: R3001; Manufacturer: YAGEO; Manufacturer PN: RC0201FR-07240RL; RK PN: 901000174; Priority: A; Wattage: 1/20W; PCB Footprint: R0201; Value: 240R; Part Type: 通用厚膜电阻; Created by: YTL; ClassName: RK
R3002 = RESISTOR: 通用厚膜电阻,240R,+/-1%,R0201,1/20W.; Part Reference: R3002; Manufacturer PN: RC0201FR-07240RL; Manufacturer: YAGEO; Wattage: 1/20W; Priority: A; RK PN: 901000174; PCB Footprint: R0201; Value: 240R; Created by: YTL; Part Type: 通用厚膜电阻; ClassName: RK
R3010 = RESISTOR: 通用厚膜电阻,20K,+/-5%,R0402,1/16W.; Part Reference: R3010; Manufacturer PN: RC0402JR-0720KL; Manufacturer: YAGEO; Wattage: 1/16W; Priority: A; PCB Footprint: R0402; Value: 20K; Created by: YTL; Part Type: 通用厚膜电阻; RK PN: RC0402JR-0720KL; ClassName: RK
R3011 = RESISTOR: 通用厚膜电阻,2K,+/-1%,R0402,1/16W.; Part Reference: R3011; Manufacturer: YAGEO; RK PN: RC0402FR-072KL; Priority: A; Wattage: 1/16W; PCB Footprint: R0402; Value: 2K; Part Type: 通用厚膜电阻; Manufacturer PN: RC0402FR-072KL; Created by: YTL; ClassName: RK
R3012 = RESISTOR: 通用厚膜电阻,100K,+/-1%,R0402,1/16W.; Part Reference: R3012; Manufacturer: YAGEO; RK PN: RC0402FR-07100KL; Priority: A; Wattage: 1/16W; PCB Footprint: R0402; Value: 100K; Part Type: 通用厚膜电阻; Manufacturer PN: RC0402FR-07100KL; Created by: YTL; ClassName: RK
R3013 = RESISTOR: 通用厚膜电阻,0R,+/-5%,R0402,1/16W.; Part Reference: R3013; Manufacturer: YAGEO; RK PN: RC0402JR-070RL; Priority: A; Wattage: 1/16W; PCB Footprint: R0402; Value: 0R; Part Type: 通用厚膜电阻; Manufacturer PN: RC0402JR-070RL; Created by: YTL; ClassName: RK
R3014 = RESISTOR: 通用厚膜电阻,0R,+/-5%,R0402,1/16W.; Part Reference: R3014; Manufacturer PN: RC0402JR-070RL; Manufacturer: YAGEO; Wattage: 1/16W; Priority: A; PCB Footprint: R0402; Value: 0R; Created by: YTL; Part Type: 通用厚膜电阻; RK PN: RC0402JR-070RL; ClassName: RK
R3015 = RESISTOR: 厚膜低阻值电阻,0R1,+/-1%,R0603,1/10W.; Part Reference: R3015; Manufacturer: YAGEO; RK PN: RL0603FR-070R1L; Priority: A; Wattage: 1/10W; PCB Footprint: R0603; Value: 0.1R; Part Type: 厚膜低阻值电阻; Manufacturer PN: RL0603FR-070R1L; Created by: YTL; ClassName: RK
U3000 = LPDDR4_200P_0: Part Reference: U3000; PCB Footprint: BGA200_15R00X10R00X0R90; Value: LPDDR4_200P; ClassName: RK
U3002 = DCDC_SY8088: Part Reference: U3002; Manufacturer PN: SY8088AAC; Manufacturer: Silergy（矽力杰）; Priority: A; PCB Footprint: SOT_23_5; Value: SY8089AAC; Created by: JJJ; Part Type: DCDC; RK PN: SY8088AAC; ClassName: RK

## Sheet SD_TF-CARD.SchDoc
size 297 x 209 mm; SheetNumber: 15; SheetTotal: 32
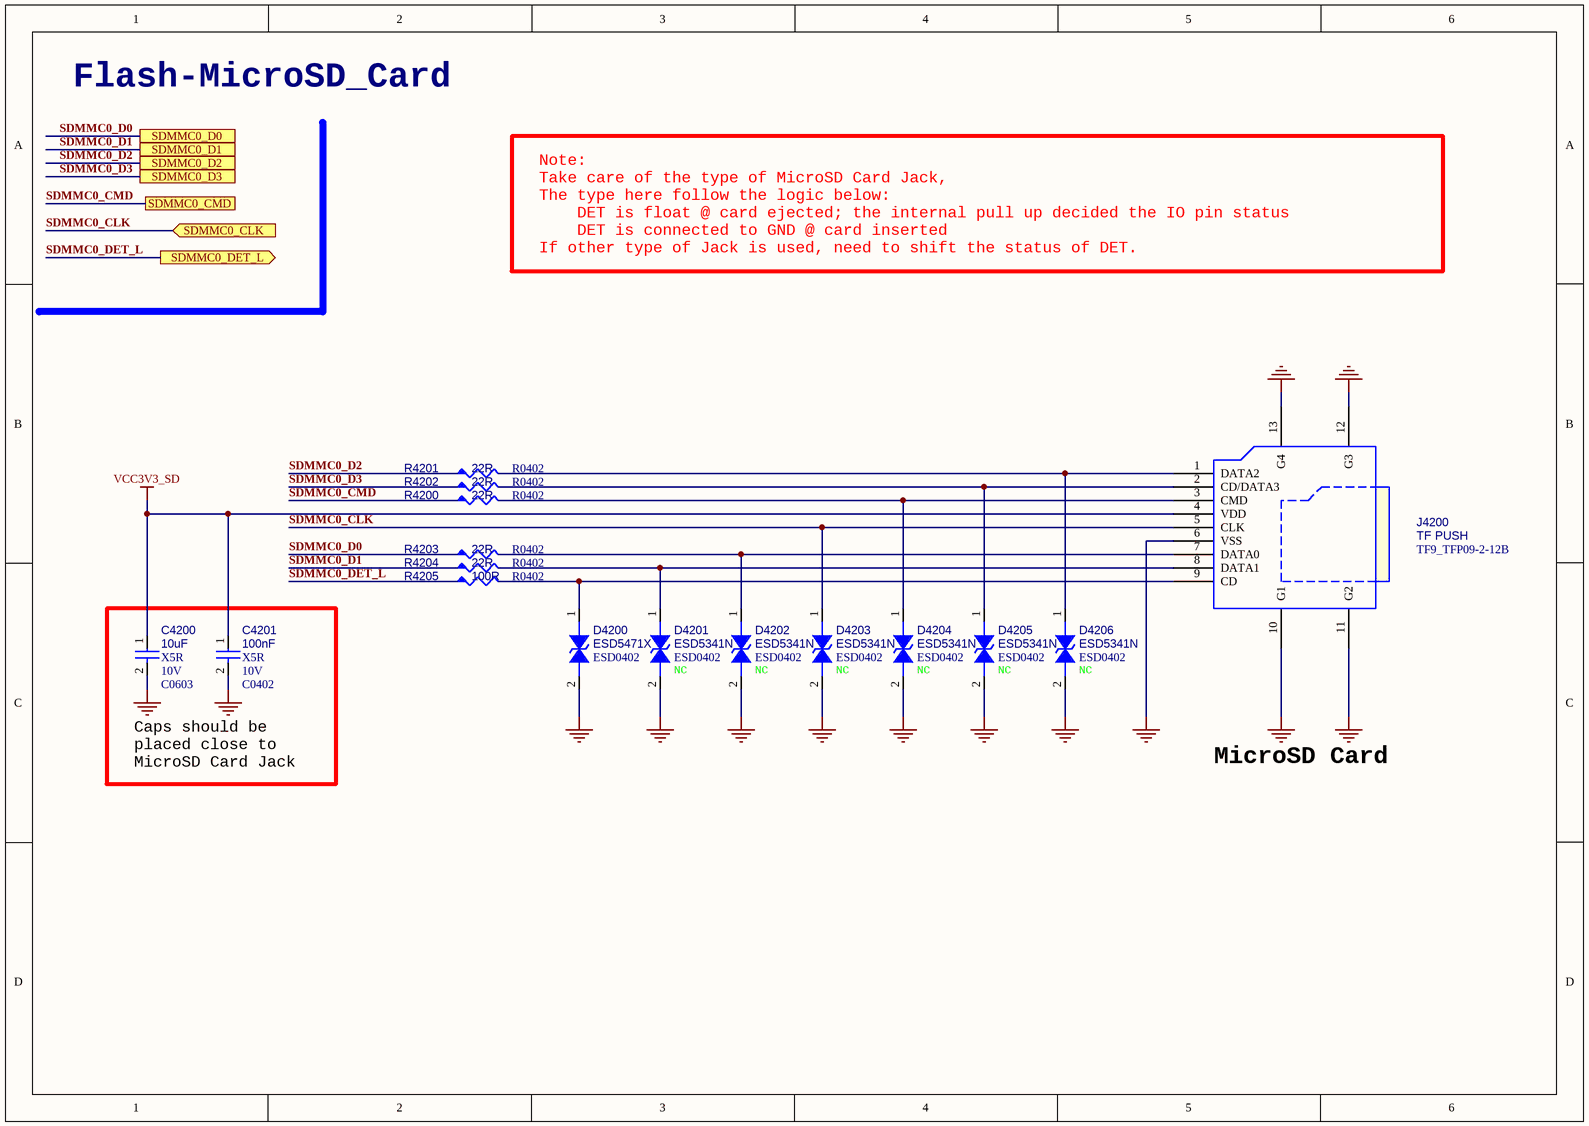
[diagram p15: SD_TF-CARD.SchDoc]

### Parts
C4200  10uF  Dielectric: X5R  Voltage: 10V  [C0603]
C4201  100nF  Dielectric: X5R  Voltage: 10V  [C0402]
D4200  ESD5471X  [ESD0402]
D4201  ESD5341N  option: NC  [ESD0402]
D4202  ESD5341N  option: NC  [ESD0402]
D4203  ESD5341N  option: NC  [ESD0402]
D4204  ESD5341N  option: NC  [ESD0402]
D4205  ESD5341N  option: NC  [ESD0402]
D4206  ESD5341N  option: NC  [ESD0402]
J4200  TF PUSH  PCB Footprint: TF9_TFP09-2-12B  [TF-SMD_TF-PUSH]
R4200  22R  [R0402]
R4201  22R  [R0402]
R4202  22R  [R0402]
R4203  22R  [R0402]
R4204  22R  [R0402]
R4205  100R  [R0402]

### Ports
SDMMC0_CLK (in, see CONTROLLER-RK3562[3B], RK3562-VCCIO2-VCCIO3[4C]), SDMMC0_CMD (see CONTROLLER-RK3562[3B], RK3562-VCCIO2-VCCIO3[4C]), SDMMC0_D0 (see CONTROLLER-RK3562[3B], RK3562-VCCIO2-VCCIO3[4C]), SDMMC0_D1 (see CONTROLLER-RK3562[3B], RK3562-VCCIO2-VCCIO3[4C]), SDMMC0_D2 (see CONTROLLER-RK3562[3B], RK3562-VCCIO2-VCCIO3[4C]), SDMMC0_D3 (see CONTROLLER-RK3562[3B], RK3562-VCCIO2-VCCIO3[4C]), SDMMC0_DET_L (out, see CONTROLLER-RK3562[3B], RK3562-PMUIO-OSC-PLL[5B])

### Nets
GND: C4200.2 C4201.2 D4200.2 D4201.2 D4202.2 D4203.2 D4204.2 D4205.2 D4206.2 J4200.6(VSS) J4200.10(G1) J4200.11(G2) J4200.12(G3) J4200.13(G4)
VCC3V3_SD: C4200.1 C4201.1 J4200.4(VDD)
SDMMC0_CLK: D4203.1 J4200.5(CLK) ; port SDMMC0_CLK
SDMMC0_CMD: R4200.1 ; port SDMMC0_CMD
SDMMC0_D0: R4203.1 ; port SDMMC0_D0
SDMMC0_D1: R4204.1 ; port SDMMC0_D1
SDMMC0_D2: R4201.1 ; port SDMMC0_D2
SDMMC0_D3: R4202.1 ; port SDMMC0_D3
SDMMC0_DET_L: R4205.1 ; port SDMMC0_DET_L  [project net SD_TF-DET-L]
NetD4200_1: D4200.1 J4200.9(CD) R4205.2
NetD4201_1: D4201.1 J4200.8(DATA1) R4204.2
NetD4202_1: D4202.1 J4200.7(DATA0) R4203.2
NetD4204_1: D4204.1 J4200.3(CMD) R4200.2
NetD4205_1: D4205.1 J4200.2(CD/DATA3) R4202.2
NetD4206_1: D4206.1 J4200.1(DATA2) R4201.2

### Notes on the sheet
- Flash-MicroSD_Card
- Note:
  Take care of the type of MicroSD Card Jack,
  The type here follow the logic below:
  DET is float @ card ejected; the internal pull up decided the IO pin status
  DET is connected to GND @ card inserted
  If other type of Jack is used, need to shift the status of DET.
- Caps should be
  placed close to
  MicroSD Card Jack
- MicroSD Card

### Library data of the parts
C4200 = CAP NP: cap,10.00uF,+/-10%,10V,X5R,C0603; Part Reference: C4200; Manufacturer PN: C1608X5R1A106K080AC; Manufacturer: TDK; Tolerance: 10%; C_Voltage: 6.3V; Priority: A; PCB Footprint: C0603; Value: 10uF; Created by: JJJ; Part Type: C0603; RK PN: C1608X5R1A106K080AC
C4201 = CAP NP: cap,100.00nF,+/-10%,10V,X5R,C0402; Part Reference: C4201; Manufacturer: TDK; RK PN: C1005X5R1A104K050BA; Priority: A; Tolerance: 10%; C_Voltage: 6.3V; PCB Footprint: C0402; Value: 100nF; Part Type: C0402; Manufacturer PN: C1005X5R1A104K050BA; Created by: JJJ
D4200 = DIODE BI_DIR TRIG: 1-Line, Bi-directional, Transient Voltage Suppressors.9pF.; Part Reference: D4200; Manufacturer: WillSemi(韦尔半导体); Priority: A; PCB Footprint: ESD0402; Value: ESD5471X; Created by: JJJ; Manufacturer PN: ESD5471X; Part Type: ESD_TVS; RK PN: ESD5471X
D4201 = DIODE BI_DIR TRIG: 1-Line, Bi-directional, Transient Voltage Suppressors.1pF.; Part Reference: D4201; Manufacturer: WillSemi(韦尔半导体); Priority: A; PCB Footprint: ESD0402; Value: ESD5341N; RK PN: ESD5341N; Part Type: ESD_TVS; Manufacturer PN: ESD5341N; Created by: JJJ
D4202 = DIODE BI_DIR TRIG: 1-Line, Bi-directional, Transient Voltage Suppressors.1pF.; Part Reference: D4202; Manufacturer: WillSemi(韦尔半导体); Priority: A; PCB Footprint: ESD0402; Value: ESD5341N; RK PN: ESD5341N; Part Type: ESD_TVS; Manufacturer PN: ESD5341N; Created by: JJJ
D4203 = DIODE BI_DIR TRIG: 1-Line, Bi-directional, Transient Voltage Suppressors.1pF.; Part Reference: D4203; Manufacturer: WillSemi(韦尔半导体); Priority: A; PCB Footprint: ESD0402; Value: ESD5341N; Created by: JJJ; Manufacturer PN: ESD5341N; Part Type: ESD_TVS; RK PN: ESD5341N
D4204 = DIODE BI_DIR TRIG: 1-Line, Bi-directional, Transient Voltage Suppressors.1pF.; Part Reference: D4204; Manufacturer: WillSemi(韦尔半导体); Priority: A; PCB Footprint: ESD0402; Value: ESD5341N; Created by: JJJ; Manufacturer PN: ESD5341N; Part Type: ESD_TVS; RK PN: ESD5341N
D4205 = DIODE BI_DIR TRIG: 1-Line, Bi-directional, Transient Voltage Suppressors.1pF.; Part Reference: D4205; Manufacturer: WillSemi(韦尔半导体); Priority: A; PCB Footprint: ESD0402; Value: ESD5341N; Created by: JJJ; Manufacturer PN: ESD5341N; Part Type: ESD_TVS; RK PN: ESD5341N
D4206 = DIODE BI_DIR TRIG: 1-Line, Bi-directional, Transient Voltage Suppressors.1pF.; Part Reference: D4206; Manufacturer: WillSemi(韦尔半导体); Priority: A; PCB Footprint: ESD0402; Value: ESD5341N; Created by: JJJ; Manufacturer PN: ESD5341N; Part Type: ESD_TVS; RK PN: ESD5341N
J4200 = TFCARD_SOCKET: 通用TF卡座，全尺寸; Part Reference: J4200; Manufacturer: 旺科达; Value: TFP09-2-12B; Priority: A; RK PN: TFP09-2-12B; Part Type: CARD Jack; Manufacturer Part Number: TFP09-2-12B; Created by: JJJ
R4200 = RESISTOR5: 通用厚膜电阻,22R,+/-5%,R0402,1/16W.; Part Reference: R4200; Manufacturer: YAGEO; Manufacturer PN: RC0402JR-0722RL; Tolerance: 5%; RK PN: 901001505; Priority: A; Wattage: 1/16W; PCB Footprint: R0402; Value: 22R; Part Type: 通用厚膜电阻; Created by: YTL
R4201 = RESISTOR5: 通用厚膜电阻,22R,+/-5%,R0402,1/16W.; Part Reference: R4201; Manufacturer: YAGEO; Manufacturer PN: RC0402JR-0722RL; Tolerance: 5%; RK PN: 901001505; Priority: A; Wattage: 1/16W; PCB Footprint: R0402; Value: 22R; Part Type: 通用厚膜电阻; Created by: YTL
R4202 = RESISTOR5: 通用厚膜电阻,22R,+/-5%,R0402,1/16W.; Part Reference: R4202; Manufacturer: YAGEO; Manufacturer PN: RC0402JR-0722RL; Tolerance: 5%; RK PN: 901001505; Priority: A; Wattage: 1/16W; PCB Footprint: R0402; Value: 22R; Part Type: 通用厚膜电阻; Created by: YTL
R4203 = RESISTOR5: 通用厚膜电阻,22R,+/-5%,R0402,1/16W.; Part Reference: R4203; Manufacturer: YAGEO; Manufacturer PN: RC0402JR-0722RL; Tolerance: 5%; RK PN: 901001505; Priority: A; Wattage: 1/16W; PCB Footprint: R0402; Value: 22R; Part Type: 通用厚膜电阻; Created by: YTL
R4204 = RESISTOR5: 通用厚膜电阻,22R,+/-5%,R0402,1/16W.; Part Reference: R4204; Manufacturer: YAGEO; Manufacturer PN: RC0402JR-0722RL; Tolerance: 5%; RK PN: 901001505; Priority: A; Wattage: 1/16W; PCB Footprint: R0402; Value: 22R; Part Type: 通用厚膜电阻; Created by: YTL
R4205 = RESISTOR5: 通用厚膜电阻,100R,+/-5%,R0402,1/16W.; Part Reference: R4205; Manufacturer PN: RC0402JR-07100RL; Manufacturer: YAGEO; Tolerance: 5%; Wattage: 1/16W; Priority: A; RK PN: 901001448; PCB Footprint: R0402; Value: 100R; Created by: YTL; Part Type: 通用厚膜电阻